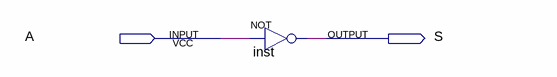
[diagram p0: schematic sheet]
// Quartus schematic Test1.bdf as structural Verilog: 1 symbols, 2 pins
module Test1 (
  input  A,
  output S
);

  not inst (S, A);
endmodule
